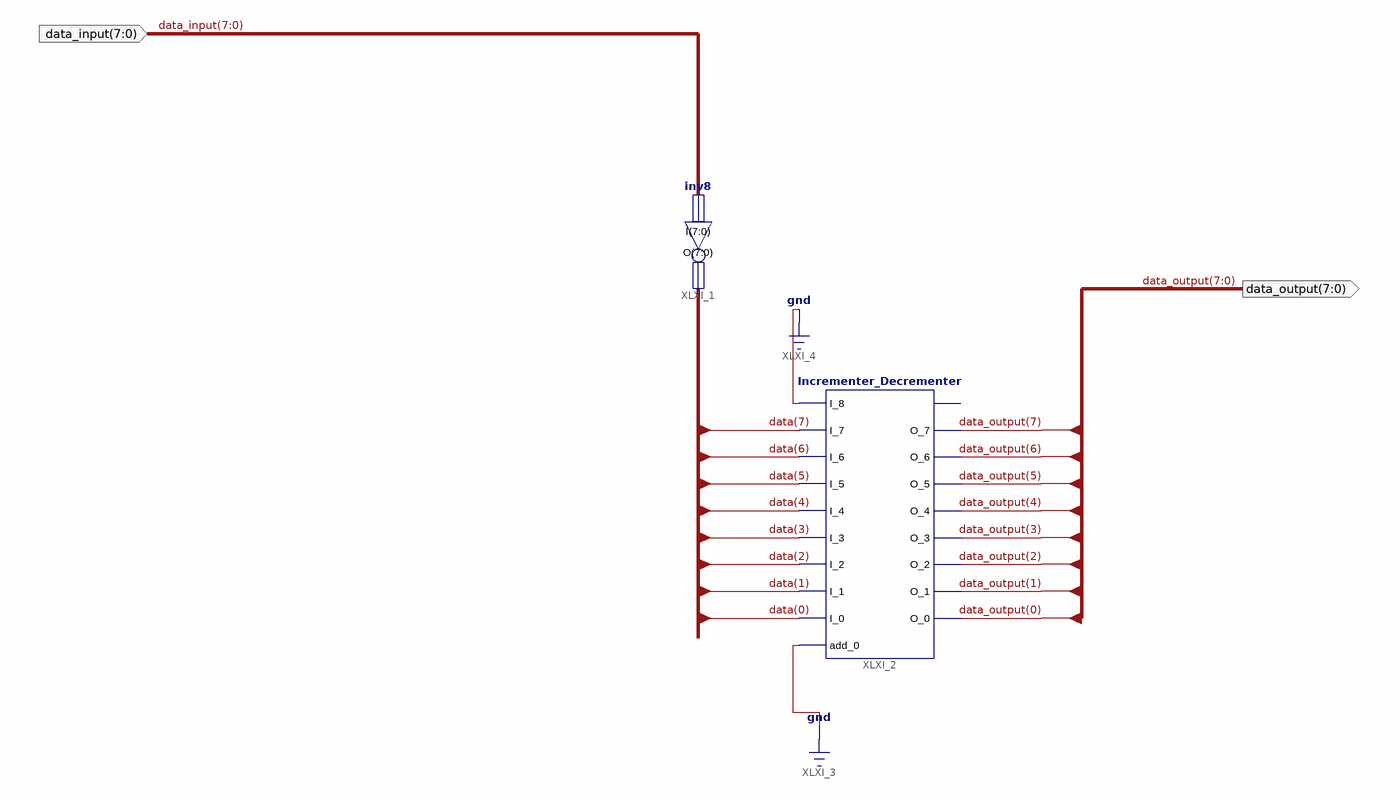
[diagram p0: schematic sheet 1]
// Xilinx ISE schematic twos_compliment_using_inverter.sch (spartan3e) as structural Verilog: 2 symbols, 2 ports
module twos_compliment_using_inverter (
  input  [7:0] data_input,
  output [7:0] data_output
);

  wire [7:0] data;

  inv8 XLXI_1 (.I(data_input), .O(data));
  Incrementer_Decrementer XLXI_2 (
    .add_0(1'b0), .I_7(data[7]), .I_6(data[6]), .I_5(data[5]), .I_4(data[4]), .I_3(data[3]), .I_2(data[2]),
    .I_1(data[1]), .I_0(data[0]), .I_8(1'b0), .O_7(data_output[7]), .O_6(data_output[6]),
    .O_5(data_output[5]), .O_4(data_output[4]), .O_3(data_output[3]), .O_2(data_output[2]),
    .O_1(data_output[1]), .O_0(data_output[0]));  // open: O_8
endmodule
